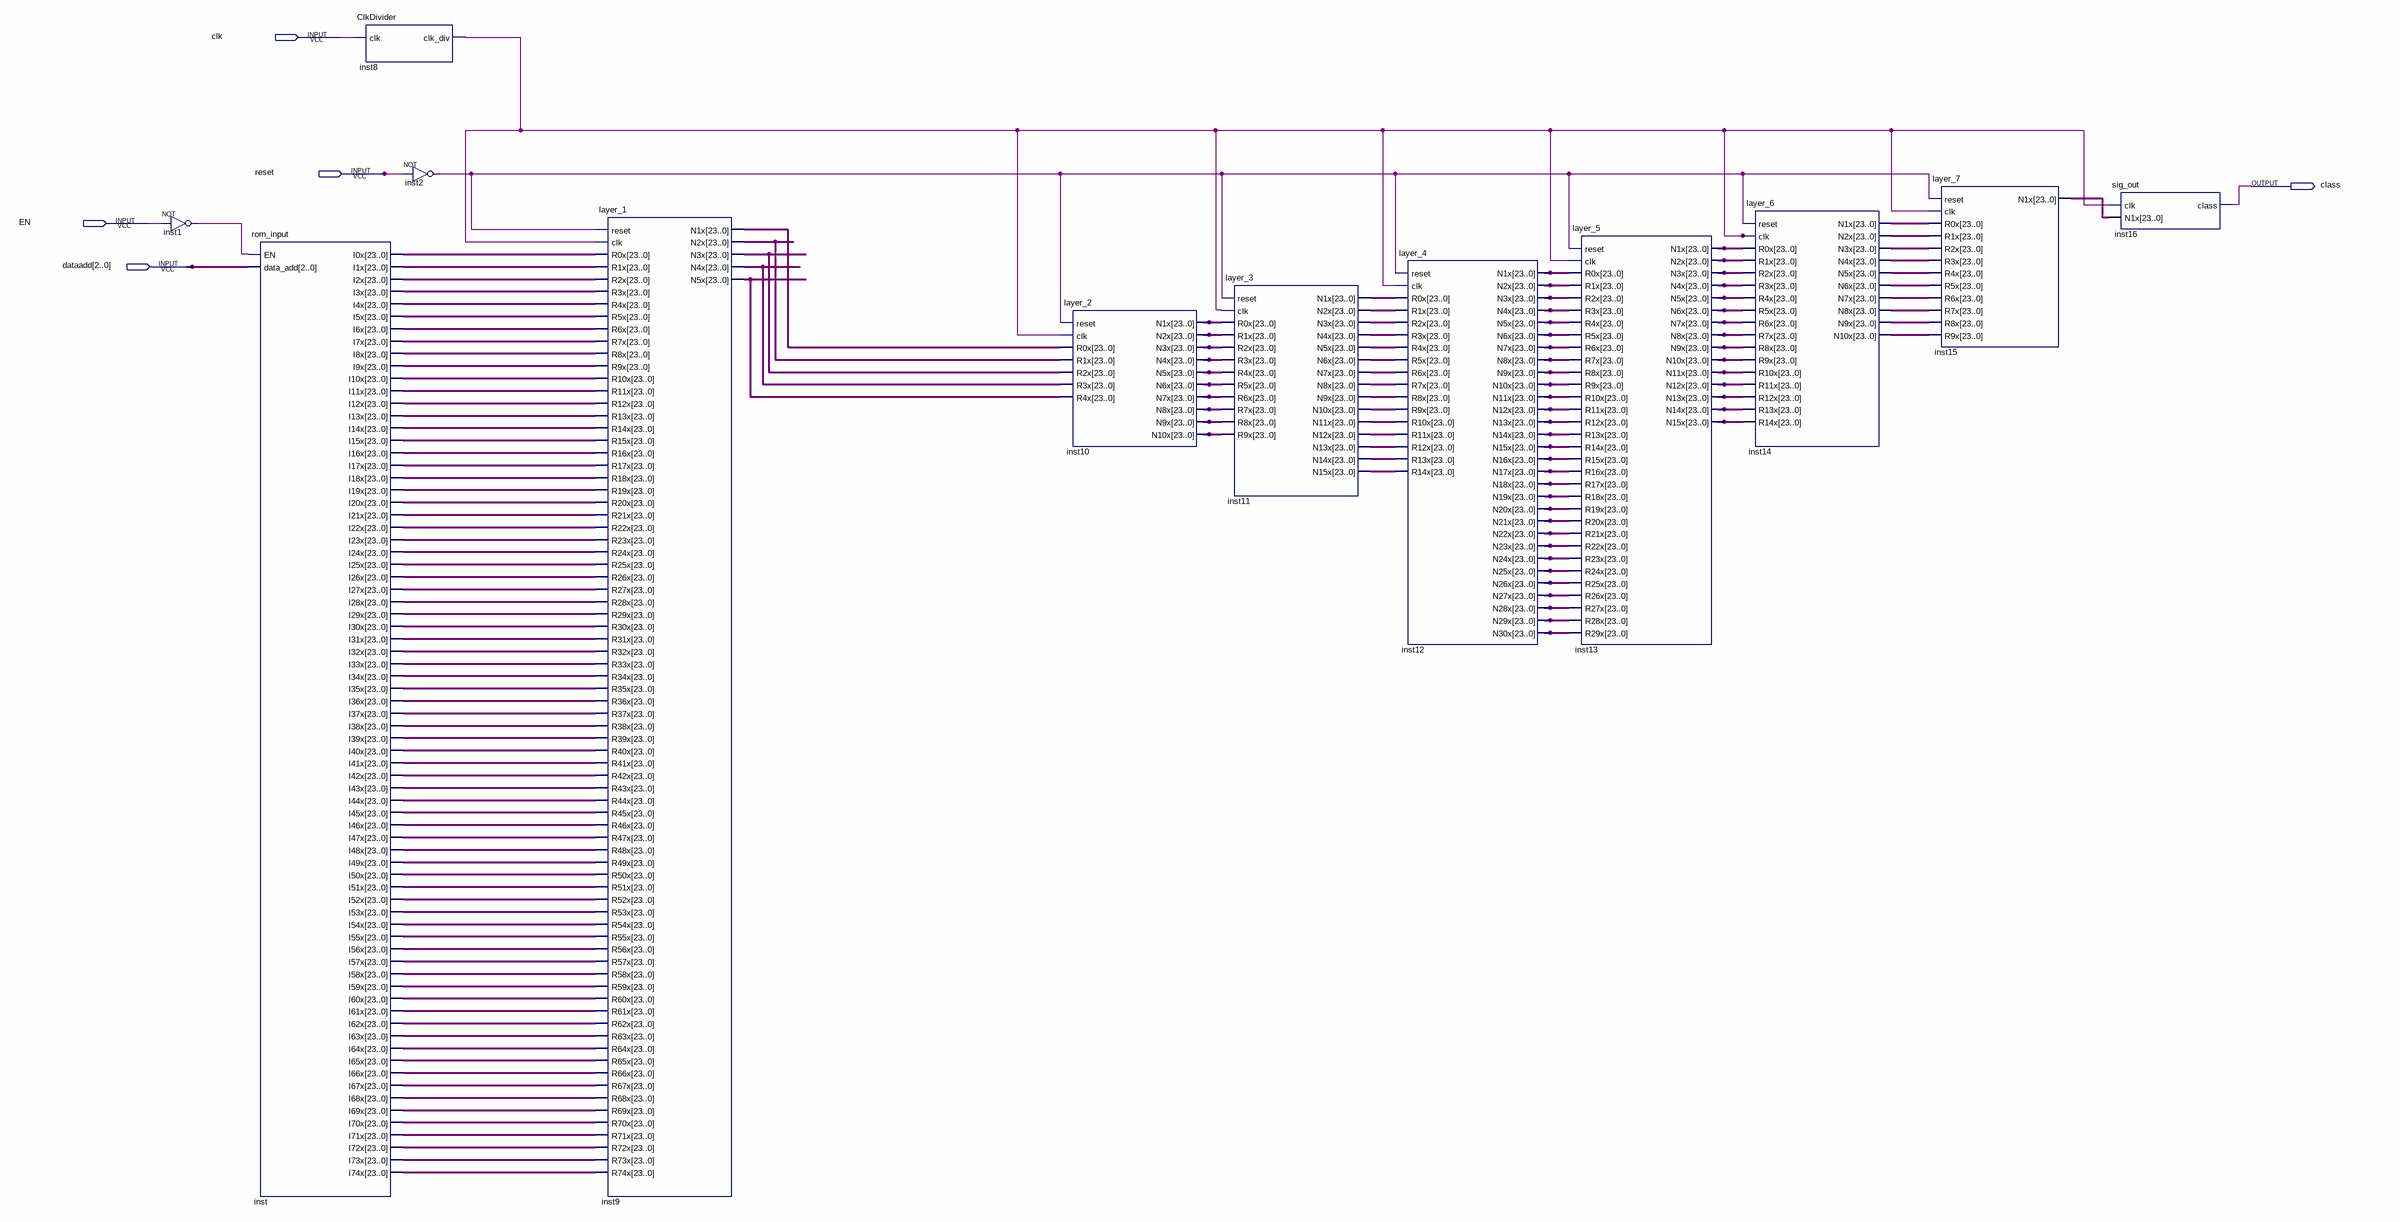
[diagram p0: schematic sheet]
// Quartus schematic layertest.bdf as structural Verilog: 12 symbols, 5 pins
module layertest (
  input  clk,
  input  reset,
  input  EN,
  input  [2:0] dataadd,
  output \class 
);

  wire inst1_out, inst2_out, inst8_clk_div;
  wire [23:0] inst9_n1x, inst9_n2x, inst9_n3x, inst9_n4x, inst9_n5x, inst10_n1x, inst10_n2x, inst10_n3x,
       inst10_n4x, inst10_n5x, inst10_n6x, inst10_n7x, inst10_n8x, inst10_n9x, inst10_n10x, inst11_n1x,
       inst11_n2x, inst11_n3x, inst11_n4x, inst11_n5x, inst11_n6x, inst11_n7x, inst11_n8x, inst11_n9x,
       inst11_n10x, inst11_n11x, inst11_n12x, inst11_n13x, inst11_n14x, inst11_n15x, inst12_n1x, inst12_n2x,
       inst12_n3x, inst12_n4x, inst12_n5x, inst12_n6x, inst12_n7x, inst12_n8x, inst12_n9x, inst12_n10x,
       inst12_n11x, inst12_n12x, inst12_n13x, inst12_n14x, inst12_n15x, inst12_n16x, inst12_n17x,
       inst12_n18x, inst12_n19x, inst12_n20x, inst12_n21x, inst12_n22x, inst12_n23x, inst12_n24x,
       inst12_n25x, inst12_n26x, inst12_n27x, inst12_n28x, inst12_n29x, inst12_n30x, inst13_n1x, inst13_n2x,
       inst13_n3x, inst13_n4x, inst13_n5x, inst13_n6x, inst13_n7x, inst13_n8x, inst13_n9x, inst13_n10x,
       inst13_n11x, inst13_n12x, inst13_n13x, inst13_n14x, inst13_n15x, inst14_n1x, inst14_n2x, inst14_n3x,
       inst14_n4x, inst14_n5x, inst14_n6x, inst14_n7x, inst14_n8x, inst14_n9x, inst14_n10x, inst15_n1x,
       inst_i0x, inst_i1x, inst_i2x, inst_i3x, inst_i4x, inst_i5x, inst_i6x, inst_i7x, inst_i8x, inst_i9x,
       inst_i10x, inst_i11x, inst_i12x, inst_i13x, inst_i14x, inst_i15x, inst_i16x, inst_i17x, inst_i18x,
       inst_i19x, inst_i20x, inst_i21x, inst_i22x, inst_i23x, inst_i24x, inst_i25x, inst_i26x, inst_i27x,
       inst_i28x, inst_i29x, inst_i30x, inst_i31x, inst_i32x, inst_i33x, inst_i34x, inst_i35x, inst_i36x,
       inst_i37x, inst_i38x, inst_i39x, inst_i40x, inst_i41x, inst_i42x, inst_i43x, inst_i44x, inst_i45x,
       inst_i46x, inst_i47x, inst_i48x, inst_i49x, inst_i50x, inst_i51x, inst_i52x, inst_i53x, inst_i54x,
       inst_i55x, inst_i56x, inst_i57x, inst_i58x, inst_i59x, inst_i60x, inst_i61x, inst_i62x, inst_i63x,
       inst_i64x, inst_i65x, inst_i66x, inst_i67x, inst_i68x, inst_i69x, inst_i70x, inst_i71x, inst_i72x,
       inst_i73x, inst_i74x;

  not inst1 (inst1_out, EN);
  rom_input inst (
    .EN(inst1_out), .data_add(dataadd), .I0x(inst_i0x), .I1x(inst_i1x), .I2x(inst_i2x), .I3x(inst_i3x),
    .I4x(inst_i4x), .I5x(inst_i5x), .I6x(inst_i6x), .I7x(inst_i7x), .I8x(inst_i8x), .I9x(inst_i9x),
    .I10x(inst_i10x), .I11x(inst_i11x), .I12x(inst_i12x), .I13x(inst_i13x), .I14x(inst_i14x),
    .I15x(inst_i15x), .I16x(inst_i16x), .I17x(inst_i17x), .I18x(inst_i18x), .I19x(inst_i19x),
    .I20x(inst_i20x), .I21x(inst_i21x), .I22x(inst_i22x), .I23x(inst_i23x), .I24x(inst_i24x),
    .I25x(inst_i25x), .I26x(inst_i26x), .I27x(inst_i27x), .I28x(inst_i28x), .I29x(inst_i29x),
    .I30x(inst_i30x), .I31x(inst_i31x), .I32x(inst_i32x), .I33x(inst_i33x), .I34x(inst_i34x),
    .I35x(inst_i35x), .I36x(inst_i36x), .I37x(inst_i37x), .I38x(inst_i38x), .I39x(inst_i39x),
    .I40x(inst_i40x), .I41x(inst_i41x), .I42x(inst_i42x), .I43x(inst_i43x), .I44x(inst_i44x),
    .I45x(inst_i45x), .I46x(inst_i46x), .I47x(inst_i47x), .I48x(inst_i48x), .I49x(inst_i49x),
    .I50x(inst_i50x), .I51x(inst_i51x), .I52x(inst_i52x), .I53x(inst_i53x), .I54x(inst_i54x),
    .I55x(inst_i55x), .I56x(inst_i56x), .I57x(inst_i57x), .I58x(inst_i58x), .I59x(inst_i59x),
    .I60x(inst_i60x), .I61x(inst_i61x), .I62x(inst_i62x), .I63x(inst_i63x), .I64x(inst_i64x),
    .I65x(inst_i65x), .I66x(inst_i66x), .I67x(inst_i67x), .I68x(inst_i68x), .I69x(inst_i69x),
    .I70x(inst_i70x), .I71x(inst_i71x), .I72x(inst_i72x), .I73x(inst_i73x), .I74x(inst_i74x));
  ClkDivider inst8 (.clk(clk), .clk_div(inst8_clk_div));
  not inst2 (inst2_out, reset);
  layer_1 inst9 (
    .reset(inst2_out), .clk(inst8_clk_div), .R0x(inst_i0x), .R1x(inst_i1x), .R2x(inst_i2x), .R3x(inst_i3x),
    .R4x(inst_i4x), .R5x(inst_i5x), .R6x(inst_i6x), .R7x(inst_i7x), .R8x(inst_i8x), .R9x(inst_i9x),
    .R10x(inst_i10x), .R11x(inst_i11x), .R12x(inst_i12x), .R13x(inst_i13x), .R14x(inst_i14x),
    .R15x(inst_i15x), .R16x(inst_i16x), .R17x(inst_i17x), .R18x(inst_i18x), .R19x(inst_i19x),
    .R20x(inst_i20x), .R21x(inst_i21x), .R22x(inst_i22x), .R23x(inst_i23x), .R24x(inst_i24x),
    .R25x(inst_i25x), .R26x(inst_i26x), .R27x(inst_i27x), .R28x(inst_i28x), .R29x(inst_i29x),
    .R30x(inst_i30x), .R31x(inst_i31x), .R32x(inst_i32x), .R33x(inst_i33x), .R34x(inst_i34x),
    .R35x(inst_i35x), .R36x(inst_i36x), .R37x(inst_i37x), .R38x(inst_i38x), .R39x(inst_i39x),
    .R40x(inst_i40x), .R41x(inst_i41x), .R42x(inst_i42x), .R43x(inst_i43x), .R44x(inst_i44x),
    .R45x(inst_i45x), .R46x(inst_i46x), .R47x(inst_i47x), .R48x(inst_i48x), .R49x(inst_i49x),
    .R50x(inst_i50x), .R51x(inst_i51x), .R52x(inst_i52x), .R53x(inst_i53x), .R54x(inst_i54x),
    .R55x(inst_i55x), .R56x(inst_i56x), .R57x(inst_i57x), .R58x(inst_i58x), .R59x(inst_i59x),
    .R60x(inst_i60x), .R61x(inst_i61x), .R62x(inst_i62x), .R63x(inst_i63x), .R64x(inst_i64x),
    .R65x(inst_i65x), .R66x(inst_i66x), .R67x(inst_i67x), .R68x(inst_i68x), .R69x(inst_i69x),
    .R70x(inst_i70x), .R71x(inst_i71x), .R72x(inst_i72x), .R73x(inst_i73x), .R74x(inst_i74x),
    .N1x(inst9_n1x), .N2x(inst9_n2x), .N3x(inst9_n3x), .N4x(inst9_n4x), .N5x(inst9_n5x));
  layer_2 inst10 (
    .reset(inst2_out), .clk(inst8_clk_div), .R0x(inst9_n1x), .R1x(inst9_n2x), .R2x(inst9_n3x),
    .R3x(inst9_n4x), .R4x(inst9_n5x), .N1x(inst10_n1x), .N2x(inst10_n2x), .N3x(inst10_n3x), .N4x(inst10_n4x),
    .N5x(inst10_n5x), .N6x(inst10_n6x), .N7x(inst10_n7x), .N8x(inst10_n8x), .N9x(inst10_n9x),
    .N10x(inst10_n10x));
  layer_3 inst11 (
    .reset(inst2_out), .clk(inst8_clk_div), .R0x(inst10_n1x), .R1x(inst10_n2x), .R2x(inst10_n3x),
    .R3x(inst10_n4x), .R4x(inst10_n5x), .R5x(inst10_n6x), .R6x(inst10_n7x), .R7x(inst10_n8x),
    .R8x(inst10_n9x), .R9x(inst10_n10x), .N1x(inst11_n1x), .N2x(inst11_n2x), .N3x(inst11_n3x),
    .N4x(inst11_n4x), .N5x(inst11_n5x), .N6x(inst11_n6x), .N7x(inst11_n7x), .N8x(inst11_n8x),
    .N9x(inst11_n9x), .N10x(inst11_n10x), .N11x(inst11_n11x), .N12x(inst11_n12x), .N13x(inst11_n13x),
    .N14x(inst11_n14x), .N15x(inst11_n15x));
  layer_4 inst12 (
    .reset(inst2_out), .clk(inst8_clk_div), .R0x(inst11_n1x), .R1x(inst11_n2x), .R2x(inst11_n3x),
    .R3x(inst11_n4x), .R4x(inst11_n5x), .R5x(inst11_n6x), .R6x(inst11_n7x), .R7x(inst11_n8x),
    .R8x(inst11_n9x), .R9x(inst11_n10x), .R10x(inst11_n11x), .R11x(inst11_n12x), .R12x(inst11_n13x),
    .R13x(inst11_n14x), .R14x(inst11_n15x), .N1x(inst12_n1x), .N2x(inst12_n2x), .N3x(inst12_n3x),
    .N4x(inst12_n4x), .N5x(inst12_n5x), .N6x(inst12_n6x), .N7x(inst12_n7x), .N8x(inst12_n8x),
    .N9x(inst12_n9x), .N10x(inst12_n10x), .N11x(inst12_n11x), .N12x(inst12_n12x), .N13x(inst12_n13x),
    .N14x(inst12_n14x), .N15x(inst12_n15x), .N16x(inst12_n16x), .N17x(inst12_n17x), .N18x(inst12_n18x),
    .N19x(inst12_n19x), .N20x(inst12_n20x), .N21x(inst12_n21x), .N22x(inst12_n22x), .N23x(inst12_n23x),
    .N24x(inst12_n24x), .N25x(inst12_n25x), .N26x(inst12_n26x), .N27x(inst12_n27x), .N28x(inst12_n28x),
    .N29x(inst12_n29x), .N30x(inst12_n30x));
  layer_5 inst13 (
    .reset(inst2_out), .clk(inst8_clk_div), .R0x(inst12_n1x), .R1x(inst12_n2x), .R2x(inst12_n3x),
    .R3x(inst12_n4x), .R4x(inst12_n5x), .R5x(inst12_n6x), .R6x(inst12_n7x), .R7x(inst12_n8x),
    .R8x(inst12_n9x), .R9x(inst12_n10x), .R10x(inst12_n11x), .R11x(inst12_n12x), .R12x(inst12_n13x),
    .R13x(inst12_n14x), .R14x(inst12_n15x), .R15x(inst12_n16x), .R16x(inst12_n17x), .R17x(inst12_n18x),
    .R18x(inst12_n19x), .R19x(inst12_n20x), .R20x(inst12_n21x), .R21x(inst12_n22x), .R22x(inst12_n23x),
    .R23x(inst12_n24x), .R24x(inst12_n25x), .R25x(inst12_n26x), .R26x(inst12_n27x), .R27x(inst12_n28x),
    .R28x(inst12_n29x), .R29x(inst12_n30x), .N1x(inst13_n1x), .N2x(inst13_n2x), .N3x(inst13_n3x),
    .N4x(inst13_n4x), .N5x(inst13_n5x), .N6x(inst13_n6x), .N7x(inst13_n7x), .N8x(inst13_n8x),
    .N9x(inst13_n9x), .N10x(inst13_n10x), .N11x(inst13_n11x), .N12x(inst13_n12x), .N13x(inst13_n13x),
    .N14x(inst13_n14x), .N15x(inst13_n15x));
  layer_6 inst14 (
    .reset(inst2_out), .clk(inst8_clk_div), .R0x(inst13_n1x), .R1x(inst13_n2x), .R2x(inst13_n3x),
    .R3x(inst13_n4x), .R4x(inst13_n5x), .R5x(inst13_n6x), .R6x(inst13_n7x), .R7x(inst13_n8x),
    .R8x(inst13_n9x), .R9x(inst13_n10x), .R10x(inst13_n11x), .R11x(inst13_n12x), .R12x(inst13_n13x),
    .R13x(inst13_n14x), .R14x(inst13_n15x), .N1x(inst14_n1x), .N2x(inst14_n2x), .N3x(inst14_n3x),
    .N4x(inst14_n4x), .N5x(inst14_n5x), .N6x(inst14_n6x), .N7x(inst14_n7x), .N8x(inst14_n8x),
    .N9x(inst14_n9x), .N10x(inst14_n10x));
  layer_7 inst15 (
    .reset(inst2_out), .clk(inst8_clk_div), .R0x(inst14_n1x), .R1x(inst14_n2x), .R2x(inst14_n3x),
    .R3x(inst14_n4x), .R4x(inst14_n5x), .R5x(inst14_n6x), .R6x(inst14_n7x), .R7x(inst14_n8x),
    .R8x(inst14_n9x), .R9x(inst14_n10x), .N1x(inst15_n1x));
  sig_out inst16 (.clk(inst8_clk_div), .N1x(inst15_n1x), .\class (\class ));
endmodule
